# Altium schematic sheet D_conn_1P25A.SchDoc
size A; SheetNumber: 6; SheetTotal: 17
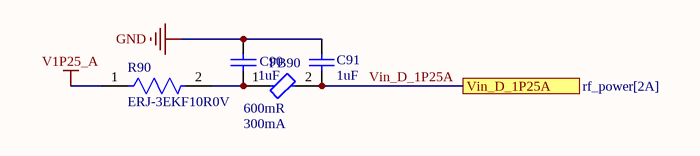
[diagram p0: D_conn_1P25A.SchDoc]

## Parts
C90  value 1uF  [CAPC2013X145X50LL20T25]  (hidden comment: C0805C105K4PACTU)
C91  value 1uF  [CAPC2013X145X50LL20T25]  (hidden comment: C0805C105K4PACTU)
FB90  DC Resistance-Max: 600mR  Max DC Current: 300mA  [FP-BLM15-0_05-MFG]  (hidden comment: BLM15AG601SN1D)
R90  ERJ-3EKF10R0V  [FP-ERJ3EK-MFG]

## Ports
Vin_D_1P25A (see rf_power[2A])

## Nets
GND: C90.2 C91.2
V1P25_A: R90.1
Vin_D_1P25A: C91.1 FB90.2 ; port Vin_D_1P25A
NetC90_1: C90.1 FB90.1 R90.2

## Library data of the parts
C90 C91 = CMP-1036-04746-2: Manufacturer: Kemet; Part Number: C0805C105K4PACTU
FB90 = CMP-0686-00187-4: Chip Ferrite Bead, 0402, 600Ω @ 100MHz, 0.52Ω, 25%, 300mA; Number of Lines: 1; DC Resistance (DCR): 520mR; Shielding: Unshielded; Impedance: 600R; Material: Steel; Frequency: 100MHz; Lead Free: Lead Free; Test Frequency: 100MHz; Depth: 0.55mm; Length: 1mm; Case Code (Imperial): 0402; Packaging: Tape and Reel; Height: 0.5mm; Max Operating Temperature: 125°C; Military Standard: Not; REACH SVHC: No SVHC; Case Code (Metric): 1005; Series: BLM15AG_SN; Core Material: Ferrite; Termination: SMD/SMT; DC Current: 300mA; Package Quantity: 10000; Width: 0.5mm; RoHS Compliant: Yes; Min Operating Temperature: -55°C; Current Rating: 300mA; Case/Package: 0402; Number of Pins: 2; Radiation Hardening: No; Tolerance: 25%; Number of Circuits: 1; Max Current Rating: 300mA
R90 = CMP-2000-00195-2: RES SMD 10 OHM 1% 1/10W 0603; Manufacturer: Panasonic; Resistance: 10Ω; Voltage Rating: 75V; Value: 10Ω; Power: 100mW; Power Rating: 0.1W; Temperature Coefficient: 100ppm/°C; Automotive Grade: Grade 0; Lead Free: Yes; Device Class L1: Passive Components; Digikey Description: RES SMD 10 OHM 1% 1/10W 0603; Octopart: https://octopart.com/erj-3ekf10r0v-panasonic-55403649; Automotive: Yes; ComponentLink2URL: https://b2b-api.panasonic.eu/file_stream/pids/fileversion/1263; Manufacturer Part Number: ERJ-3EKF10R0V; Height: 0.55mm; Temperature Range High: +155°C; Footprint Url: https://industrial.panasonic.com/cdbs/www-data/pdf/RDA0000/DMA0000COL17.pdf; Temperature: -55°C to +155°C; Tolerance: 1%; ComponentLink2Description: Datasheet; Package: ERJ3EK; Device Class L2: Resistors; Category: Res; Ipc Land Pattern Name: RESC16080X45; RoHS: TRUE; Composition: Thick Film; Device Class L3: Chip SMD Resistors; Temperature Range Low: -55°C; Series: ERJ